# Altium project PolychaetaV0.PrjPcb
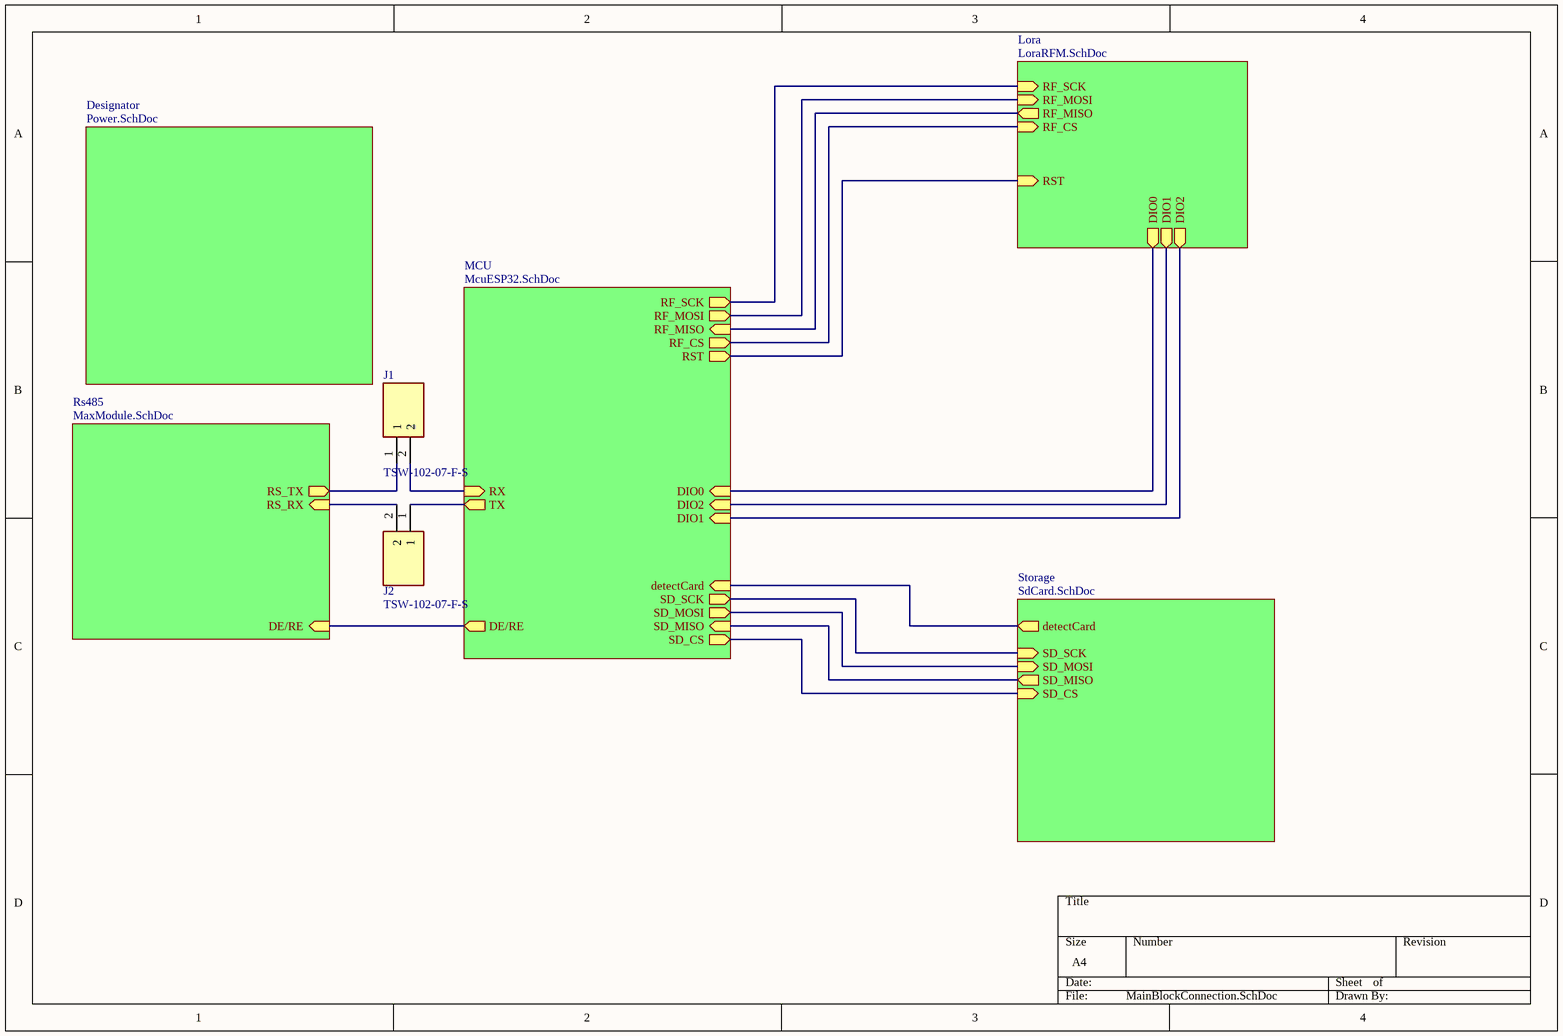
[diagram p0: MainBlockConnection.SchDoc]
6 sheets, 61 parts. Net scope: hierarchical (ports join the sheet entries above them; power ports are global).
Board file: PCBPolyESP.PcbDoc
Sheets:
  MainBlockConnection.SchDoc
    MCU = McuESP32.SchDoc
    Designator = Power.SchDoc
    Lora = LoraRFM.SchDoc
    Rs485 = MaxModule.SchDoc
    Storage = SdCard.SchDoc

## Sheet MainBlockConnection.SchDoc
size A4; SheetNumber: 1; SheetTotal: 6

### Parts
J1  TSW-102-07-F-S  [TSW-102-XX-YY-S]
J2  TSW-102-07-F-S  [TSW-102-XX-YY-S]

### Sub-sheets
Designator = Power.SchDoc: no entries
Lora = LoraRFM.SchDoc: RST (in), RF_MISO (out), RF_CS (in), RF_SCK (in), RF_MOSI (in), DIO0 (out), DIO1 (out), DIO2 (out)
MCU = McuESP32.SchDoc: TX (out), RX (in), RF_SCK (out), SD_MISO (in), SD_MOSI (out), RF_CS (out), SD_CS (out), SD_SCK (out), RF_MOSI (out), RF_MISO (in), RST (out), detectCard (in), DE/RE (out), DIO2 (in), DIO1 (in), DIO0 (in)
Rs485 = MaxModule.SchDoc: DE/RE (in), RS_TX (out), RS_RX (in)
Storage = SdCard.SchDoc: detectCard (out), SD_MOSI (in), SD_CS (in), SD_MISO (out), SD_SCK (in)

### Nets
ESP_RX: J1.2 ; sheet MCU/RX
ESP_TX: J2.1 ; sheet MCU/TX
NetIC1_8: sheet MCU/detectCard, sheet Storage/detectCard
NetIC1_9: sheet MCU/RST, sheet Lora/RST
NetIC1_10: sheet MCU/DIO2, sheet Lora/DIO1
NetIC1_11: sheet MCU/DIO1, sheet Lora/DIO2
NetIC1_12: sheet MCU/DIO0, sheet Lora/DIO0
NetIC1_13: sheet MCU/RF_SCK, sheet Lora/RF_SCK
NetIC1_14: sheet MCU/RF_MISO, sheet Lora/RF_MISO
NetIC1_16: sheet MCU/RF_MOSI, sheet Lora/RF_MOSI
NetIC1_23: sheet MCU/RF_CS, sheet Lora/RF_CS
NetIC1_29: sheet MCU/SD_CS, sheet Storage/SD_CS
NetIC1_30: sheet MCU/SD_SCK, sheet Storage/SD_SCK
NetIC1_31: sheet MCU/SD_MISO, sheet Storage/SD_MISO
NetIC1_36: sheet MCU/DE/RE, sheet Rs485/DE/RE
NetIC1_37: sheet MCU/SD_MOSI, sheet Storage/SD_MOSI
NetJ1_1: J1.1 ; sheet Rs485/RS_TX
NetJ2_2: J2.2 ; sheet Rs485/RS_RX

### Library data of the parts
J1 J2 = TSW-102-07-F-S: Connector; Manufacturer_Name: SAMTEC; Datasheet Link: http://suddendocs.samtec.com/prints/tsw-xxx-xx-xxx-x-xx-xxx-mkt.pdf; Manufacturer_Part_Number: TSW-102-07-F-S; Mouser Part Number: 200-TSW10207FS; Mouser Price/Stock: https://www.mouser.co.uk/ProductDetail/Samtec/TSW-102-07-F-S?qs=hzq9O0YpnZuC7JuvEqrjIA%3D%3D; Arrow Part Number: TSW-102-07-F-S; Arrow Price/Stock: https://www.arrow.com/en/products/tsw-102-07-f-s/samtec?utm_currency=USD&region=europe

## Sheet McuESP32.SchDoc
size A4; SheetNumber: 2; SheetTotal: 6
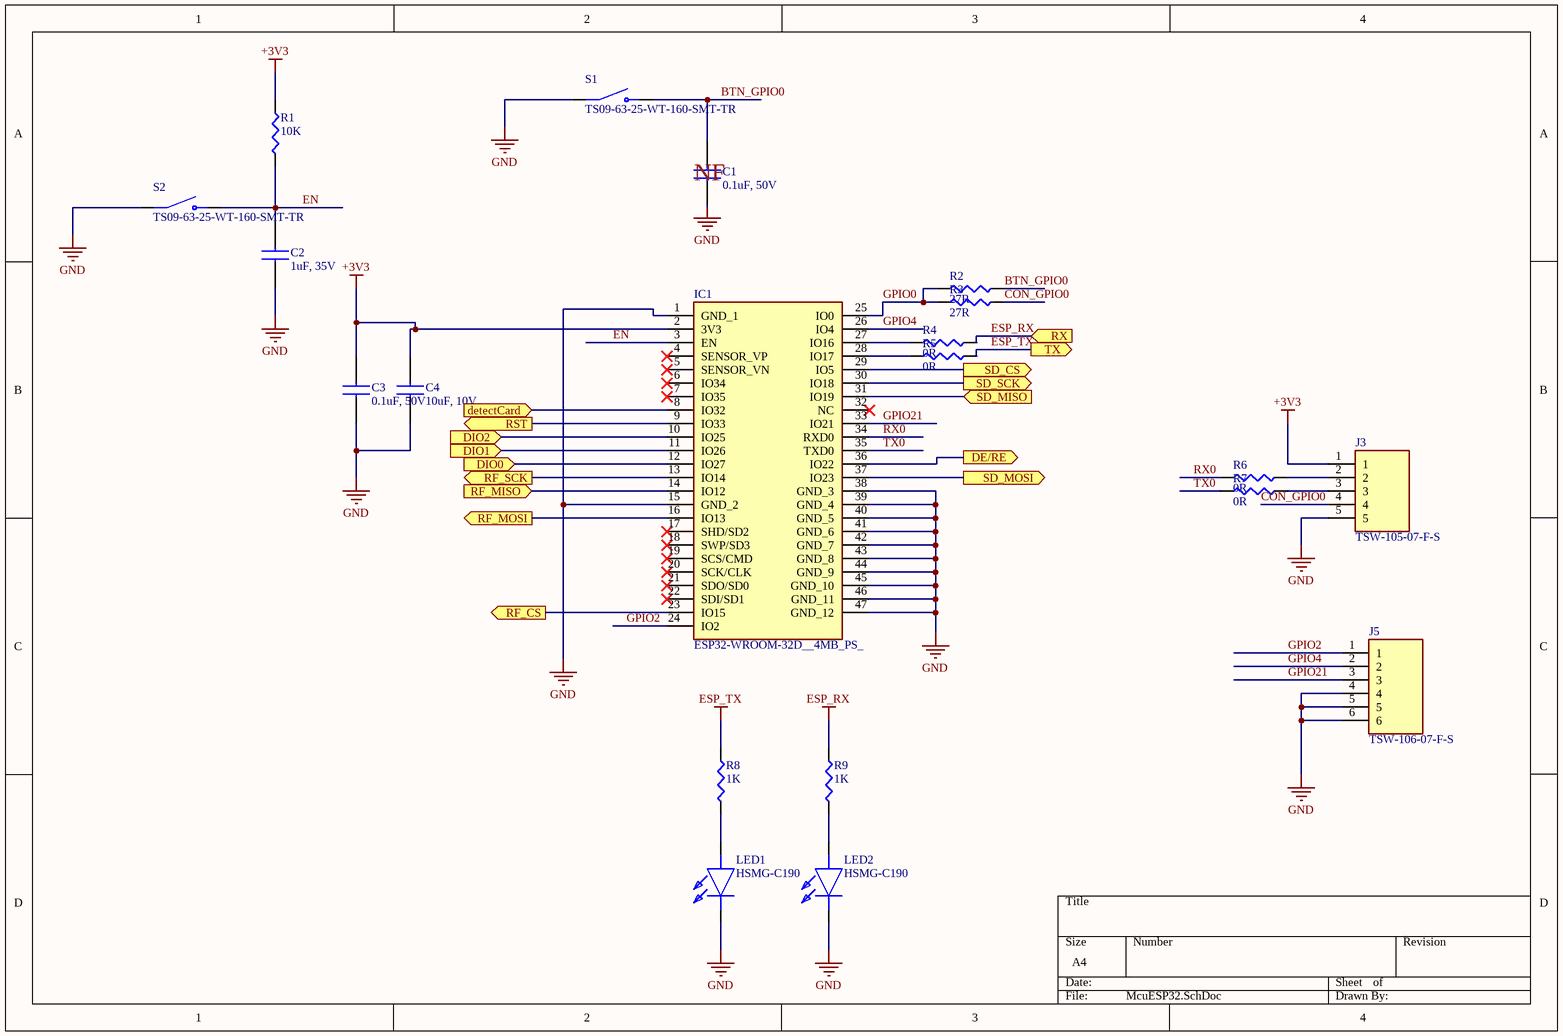
[diagram p1: McuESP32.SchDoc]

### Parts
C1  0.1uF, 50V  [CAPC1608X90N]
C2  1uF, 35V  [CAPC1608X90N]
C3  0.1uF, 50V  [CAPC1608X90N]
C4  10uF, 10V  [CAPC1608X90N]
IC1  ESP32-WROOM-32D__4MB_PS_  [ESP32WROOM32D4MBPS]
J3  TSW-105-07-F-S  [TSW-105-XX-YY-S]
J5  TSW-106-07-F-S  [TSW10607FS]
LED1  HSMG-C190  [LEDC1608X90N]
LED2  HSMG-C190  [LEDC1608X90N]
R1  10K  [RESC1607X60N]
R2  27R  [RESC1607X60N]
R3  27R  [RESC1607X60N]
R4  0R  [RESC1607X60N]
R5  0R  [RESC1607X60N]
R6  0R  [RESC1607X60N]
R7  0R  [RESC1607X60N]
R8  1K  [RESC1607X60N]
R9  1K  [RESC1607X60N]
S1  TS09-63-25-WT-160-SMT-TR  [SW_TS09-63-25-WT-160-SMT-TR]
S2  TS09-63-25-WT-160-SMT-TR  [SW_TS09-63-25-WT-160-SMT-TR]

### Ports
DE/RE (out), detectCard (in), DIO0 (in), DIO1 (in), DIO2 (in), RF_CS (out), RF_MISO (in), RF_MOSI (out), RF_SCK (out), RST (out), RX (in), SD_CS (out), SD_MISO (in), SD_MOSI (out), SD_SCK (out), TX (out)

### Nets
+3V3: C3.2 C4.1 IC1.2(3V3) J3.1 R1.2
ESP_RX: R4.2 R9.2 ; port RX
ESP_TX: R5.2 R8.2 ; port TX
GND: C1.1 C2.1 C3.1 C4.2 IC1.1(GND_1) IC1.15(GND_2) IC1.38(GND_3) IC1.39(GND_4) IC1.40(GND_5) IC1.41(GND_6) IC1.42(GND_7) IC1.43(GND_8) IC1.44(GND_9) IC1.45(GND_10) IC1.46(GND_11) IC1.47(GND_12) J3.5 J5.4 J5.5 J5.6 LED1.1(K) LED2.1(K) S1.1 S2.1
BTN_GPIO0: C1.2 R2.2 S1.2
CON_GPIO0: J3.4 R3.2
EN: C2.2 IC1.3(EN) R1.1 S2.2
GPIO0: IC1.25(IO0) R2.1 R3.1
GPIO2: IC1.24(IO2) J5.1
GPIO4: IC1.26(IO4) J5.2
GPIO21: IC1.33(IO21) J5.3
RX0: IC1.34(RXD0) R6.1
TX0: IC1.35(TXD0) R7.1
NetIC1_8: IC1.8(IO32) ; port detectCard
NetIC1_9: IC1.9(IO33) ; port RST
NetIC1_10: IC1.10(IO25) ; port DIO2
NetIC1_11: IC1.11(IO26) ; port DIO1
NetIC1_12: IC1.12(IO27) ; port DIO0
NetIC1_13: IC1.13(IO14) ; port RF_SCK
NetIC1_14: IC1.14(IO12) ; port RF_MISO
NetIC1_16: IC1.16(IO13) ; port RF_MOSI
NetIC1_23: IC1.23(IO15) ; port RF_CS
NetIC1_27: IC1.27(IO16) R4.1
NetIC1_28: IC1.28(IO17) R5.1
NetIC1_29: IC1.29(IO5) ; port SD_CS
NetIC1_30: IC1.30(IO18) ; port SD_SCK
NetIC1_31: IC1.31(IO19) ; port SD_MISO
NetIC1_36: IC1.36(IO22) ; port DE/RE
NetIC1_37: IC1.37(IO23) ; port SD_MOSI
NetJ3_2: J3.2 R6.2
NetJ3_3: J3.3 R7.2
NetLED1_2: LED1.2(A) R8.1
NetLED2_2: LED2.2(A) R9.1

Not connected (* = marked no-connect by the designer): IC1 4(SENSOR_VP)* 5(SENSOR_VN)* 6(IO34)* 7(IO35)* 17(SHD/SD2)* 18(SWP/SD3)* 19(SCS/CMD)* 20(SCK/CLK)* 21(SDO/SD0)* 22(SDI/SD1)* 32(NC)*

### Notes on the sheet
- (near C1) NF

### Library data of the parts
C1 C3 = CL10B104KB8NNNL: CAP CER 0.1UF 50V X7R 0603; Manufacturer_Name: SAMSUNG; Datasheet Link: https://componentsearchengine.com/Datasheets/2/CL10A106MP8NNNC.pdf; Height: 0.9mm; Manufacturer_Part_Number: CL10B104KB8NNNL; Mouser Part Number: 187-CL10A106MP8NNNC; Mouser Price/Stock: https://www.mouser.co.uk/ProductDetail/Samsung-Electro-Mechanics/CL10A106MP8NNNC?qs=X6jEic%2FHinAgjcVTZfg7UA%3D%3D; Arrow Part Number: CL10A106MP8NNNC; Arrow Price/Stock: https://www.arrow.com/en/products/cl10a106mp8nnnc/samsung-electro-mechanics?utm_currency=USD&region=europe
C2 = CL10A105KL8NNNC: Ceramic Capacitor, Multilayer, Ceramic, 35V, 10% +Tol, 10% -Tol, X5R, +-15% TC, 1uF, Surface Mount, 0603 inch; Manufacturer: Samsung; Material: 4241ConductorMaterial; Supplier 1: Digikey; Manufacturer Part Number: CL10A105KL8NNNC; RoHS: Yes; Category: Ceramic Capacitors; Stock 1: 11037; Pricing 1: 1=0,13, 10=0,073, 100=0,044, 1000=0,03277 (USD); Voltage Rating (DC): 35V; Height: 900um; Lead Free: 5697LeadFree; ComponentLink1URL: https://datasheet.ciiva.com/25773/cl10a105kl8nnnc-25773809.pdf?src-supplier=Digikey; ComponentLink1Description: https://datasheet.ciiva.com/25773/cl10a105kl8nnnc-25773809.pdf?src-supplier=Digikey; ComponentLink2URL: https://datasheet.ciiva.com/16202/clseries-16202344.pdf?src-supplier=Future+Electronics; ComponentLink2Description: https://datasheet.ciiva.com/16202/clseries-16202344.pdf?src-supplier=Future+Electronics
C4 = CL10A106MP8NNNC: CAP CER 10UF 10V X5R 0603; Manufacturer_Name: SAMSUNG; Datasheet Link: https://componentsearchengine.com/Datasheets/2/CL10A106MP8NNNC.pdf; Height: 0.9mm; Manufacturer_Part_Number: CL10A106MP8NNNC; Mouser Part Number: 187-CL10A106MP8NNNC; Mouser Price/Stock: https://www.mouser.co.uk/ProductDetail/Samsung-Electro-Mechanics/CL10A106MP8NNNC?qs=X6jEic%2FHinAgjcVTZfg7UA%3D%3D; Arrow Part Number: CL10A106MP8NNNC; Arrow Price/Stock: https://www.arrow.com/en/products/cl10a106mp8nnnc/samsung-electro-mechanics?utm_currency=USD&region=europe
IC1 = ESP32-WROOM-32D__4MB_PS_: Integrated Circuit; Manufacturer_Name: Espressif Systems; Manufacturer_Part_Number: ESP32-WROOM-32D (4MB PS); Datasheet Link: https://www.mouser.com/datasheet/2/891/esp32-wroom-32d_esp32-wroom-32u_datasheet_en-1365844.pdf; Height: 3.2mm; Mouser Part Number: 356-ESPWROOM3200PS3; Mouser Price/Stock: https://www.mouser.co.uk/ProductDetail/Espressif-Systems/ESP32-WROOM-32D-4MB-PS?qs=GBLSl2Akirs5uooPY1MBgw%3D%3D
J3 = TSW-105-07-F-S: Connector; Manufacturer_Name: SAMTEC; Datasheet Link: http://suddendocs.samtec.com/prints/tsw-xxx-xx-xxx-x-xx-xxx-mkt.pdf; Manufacturer_Part_Number: TSW-105-07-F-S; Mouser Part Number: 200-TSW10507FS; Mouser Price/Stock: https://www.mouser.co.uk/ProductDetail/Samtec/TSW-105-07-F-S?qs=rU5fayqh%252BE0rjSr2FD4jkw%3D%3D; Arrow Part Number: TSW-105-07-F-S; Arrow Price/Stock: https://www.arrow.com/en/products/tsw-105-07-f-s/samtec?region=europe
J5 = TSW-106-07-F-S: Connector; Manufacturer_Name: SAMTEC; Datasheet Link: http://suddendocs.samtec.com/prints/tsw-xxx-xx-xxx-x-xx-xxx-mkt.pdf; Height: 8.38mm; Manufacturer_Part_Number: TSW-106-07-F-S; Mouser Part Number: 200-TSW10607FS; Mouser Price/Stock: https://www.mouser.co.uk/ProductDetail/Samtec/TSW-106-07-F-S?qs=rU5fayqh%252BE1Xwj0%2Fe2Xn%2Fw%3D%3D; Arrow Part Number: TSW-106-07-F-S; Arrow Price/Stock: https://www.arrow.com/en/products/tsw-106-07-f-s/samtec?region=nac
LED1 LED2 = HSMG-C190: Green LED 0603 (1608 Metric); Manufacturer_Name: Avago Technologies; Datasheet Link: https://docs.broadcom.com/docs/AV02-0551EN; Height: 0.9mm; Manufacturer_Part_Number: HSMG-C190; Mouser Part Number: 630-HSMG-C190; Mouser Price/Stock: https://www.mouser.co.uk/ProductDetail/Broadcom-Avago/HSMG-C190?qs=YDL0qNrpDT605sxOaps8VQ%3D%3D
R1 = RC0603JR-0710KL: RES 10K OHM 5% 1/10W 0603; Manufacturer: Yageo; Resistance: 10kR; Temperature Coefficient: 100ppm/°C; Voltage Rating (AC): 50V; Max Power Dissipation: 100mW; Supplier 1: Digikey; Manufacturer Part Number: RC0603JR-0710KL; RoHS: Yes; Category: Chip SMD Resistors; Stock 1: 50431; Pricing 1: 1=0,1, 10=0,008, 50=0,0072, 100=0,0061, 500=0,0051 (USD); Case/Package: 0603; Min Operating Temperature: -55°C; Max Operating Temperature: 155°C; Tolerance: 5%; Number of Terminations: 2; Series: RC; Reach SVHC Compliant: 4187SVHC; Lead Free: 5697LeadFree; RoHS Compliant: Yes; ComponentLink1URL: https://datasheet.ciiva.com/2452/pyu-rc-group-51-rohs-l-10-2452848.pdf?src-supplier=Digikey; ComponentLink1Description: https://datasheet.ciiva.com/2452/pyu-rc-group-51-rohs-l-10-2452848.pdf?src-supplier=Digikey
R2 R3 = RC0603JR-0727RL: RES 27 OHM 5% 1/10W 0603; Manufacturer: Yageo; Voltage Rating (AC): 50V; Supplier 1: Digikey; Manufacturer Part Number: RC0603JR-0727RL; RoHS: Yes; Category: Chip SMD Resistors; Stock 1: 235857; Pricing 1: 1=0,1, 10=0,008, 50=0,0072, 100=0,0061, 500=0,00562, 1000=0,0051 (USD); Lead Free: 5697LeadFree; ComponentLink1URL: https://datasheet.ciiva.com/7746/443971-7746479.pdf?src-supplier=Element14; ComponentLink1Description: https://datasheet.ciiva.com/7746/443971-7746479.pdf?src-supplier=Element14
R4-R7 = RC0603JR-070RL: RES 0 OHM JUMPER 1/10W 0603; Manufacturer: Yageo; Resistance: 0mR; Tolerance: 1%; Voltage Rating: 50V; Power Rating: 100mW; Temperature Coefficient: 200ppm/°C; Resistance Tolerance: 5%; Supplier 1: Digikey; Manufacturer Part Number: RC0603JR-070RL; RoHS: Yes; Category: Chip SMD Resistors; Stock 1: 2438419; Pricing 1: 1=0,1, 10=0,01, 25=0,008, 50=0,0068, 100=0,0059, 250=0,00496, 500=0,00436, 1000=0,00384, 5000=0,00292, 10000=0,00262, 15000=0,00246, 25000=0,00229, 35000=0,00218, 50000=0,00208, 125000=0,00185, 250000=0,00171, 500000=0,00159 (USD); Case/Package: 0603; Number of Pins: 2; Case Code (Imperial): 0603; Contact Plating: Tin,Matte; Case Code (Metric): 1608; Size Code: 0603; Min Operating Temperature: -55°C; Max Operating Temperature: 155°C; Packaging: Tape and Reel; Voltage Rating (DC): 50V; Termination: SMD/SMT; Package Quantity: 5000; Resistor Type: Thick Film; Features: Moisture Resistant; Series: RC; Max Power Dissipation: 100mW; Number of Terminations: 2; Construction: Rectangular; Technology: THICK FILM; Length: 1.6mm; Width: 0.8mm; Height: 0.45mm; Depth: 0.8mm; Military Standard: Not; Reach SVHC Compliant: Unknown; Lead Free: 5697LeadFree; RoHS Compliant: Yes; ComponentLink1URL: https://datasheet.ciiva.com/11808/pyu-r-int-6-11808700.pdf?src-supplier=Rs; ComponentLink1Description: https://datasheet.ciiva.com/11808/pyu-r-int-6-11808700.pdf?src-supplier=Rs; ComponentLink2URL: https://datasheet.ciiva.com/22747/443971-22747530.pdf?src-supplier=Element14; ComponentLink2Description: https://datasheet.ciiva.com/22747/443971-22747530.pdf?src-supplier=Element14; ComponentLink3URL: https://datasheet.ciiva.com/12555/rc0603-272842-12555254.pdf?src-supplier=Mouser; ComponentLink3Description: https://datasheet.ciiva.com/12555/rc0603-272842-12555254.pdf?src-supplier=Mouser; ComponentLink4URL: https://datasheet.ciiva.com/7746/1738695-7746421.pdf?src-supplier=Element14; ComponentLink4Description: https://datasheet.ciiva.com/7746/1738695-7746421.pdf?src-supplier=Element14; ComponentLink5URL: https://datasheet.ciiva.com/7746/1738695-7746422.pdf?src-supplier=Element14; ComponentLink5Description: https://datasheet.ciiva.com/7746/1738695-7746422.pdf?src-supplier=Element14
R8 R9 = RT0603BRD071KL: Fixed Resistor, Thin Film, 0.1W, 1000ohm, 75V, 0.1% +/-Tol, 25ppm/Cel, Surface Mount, 0603; Manufacturer: Yageo; Resistance: 1kR; Power Rating: 100mW; Temperature Coefficient: 25ppm/°C; Voltage Rating (DC): 50V; Supplier 1: Digikey; Manufacturer Part Number: RT0603BRD071KL; RoHS: Yes; Category: Chip SMD Resistors; Stock 1: 60333; Pricing 1: 1=0,15, 10=0,108, 50=0,0868, 100=0,0775, 500=0,06018, 1000=0,05202 (USD); Mount: Surface Mount; Case/Package: 0603; Case Code (Metric): 1608; Case Code (Imperial): 0603; Contact Plating: Tin,Lead; Size Code: 0603; Min Operating Temperature: -55°C; Max Operating Temperature: 155°C; Package Quantity: 5000; Packaging: Tape and Reel; Voltage Rating: 75V; Number of Terminations: 2; Termination: SMD/SMT; Max Power Dissipation: 100mW; Features: Moisture Resistant; Series: RT; Technology: THIN FILM; Length: 0.063inch; Width: 0.031inch; Height: 0.022inch; Depth: 0.8mm; RoHS Compliant: Yes; Lead Free: 5697LeadFree; ComponentLink1URL: https://datasheet.ciiva.com/11819/0900766b8079c86e-11819652.pdf?src-supplier=Rs; ComponentLink1Description: https://datasheet.ciiva.com/11819/0900766b8079c86e-11819652.pdf?src-supplier=Rs; ComponentLink2URL: https://datasheet.ciiva.com/5624/pyu-rt-1-to-0-05-rohs-l-4-5624759.pdf?src-supplier=Mouser; ComponentLink2Description: https://datasheet.ciiva.com/5624/pyu-rt-1-to-0-05-rohs-l-4-5624759.pdf?src-supplier=Mouser
S1 S2 = TS09-63-25-WT-160-SMT-TR: SWITCH TACTILE SPST-NO 0.05A 12V; MF: Same Sky; SnapEDA_Link: https://www.snapeda.com/parts/TS09-63-25-WT-160-SMT-TR/Same+Sky/view-part/?ref=snap; Package: None; Value: *; MP: TS09-63-25-WT-160-SMT-TR; Check_prices: https://www.snapeda.com/parts/TS09-63-25-WT-160-SMT-TR/Same+Sky/view-part/?ref=eda

## Sheet Power.SchDoc
size A4; SheetNumber: 3; SheetTotal: 6
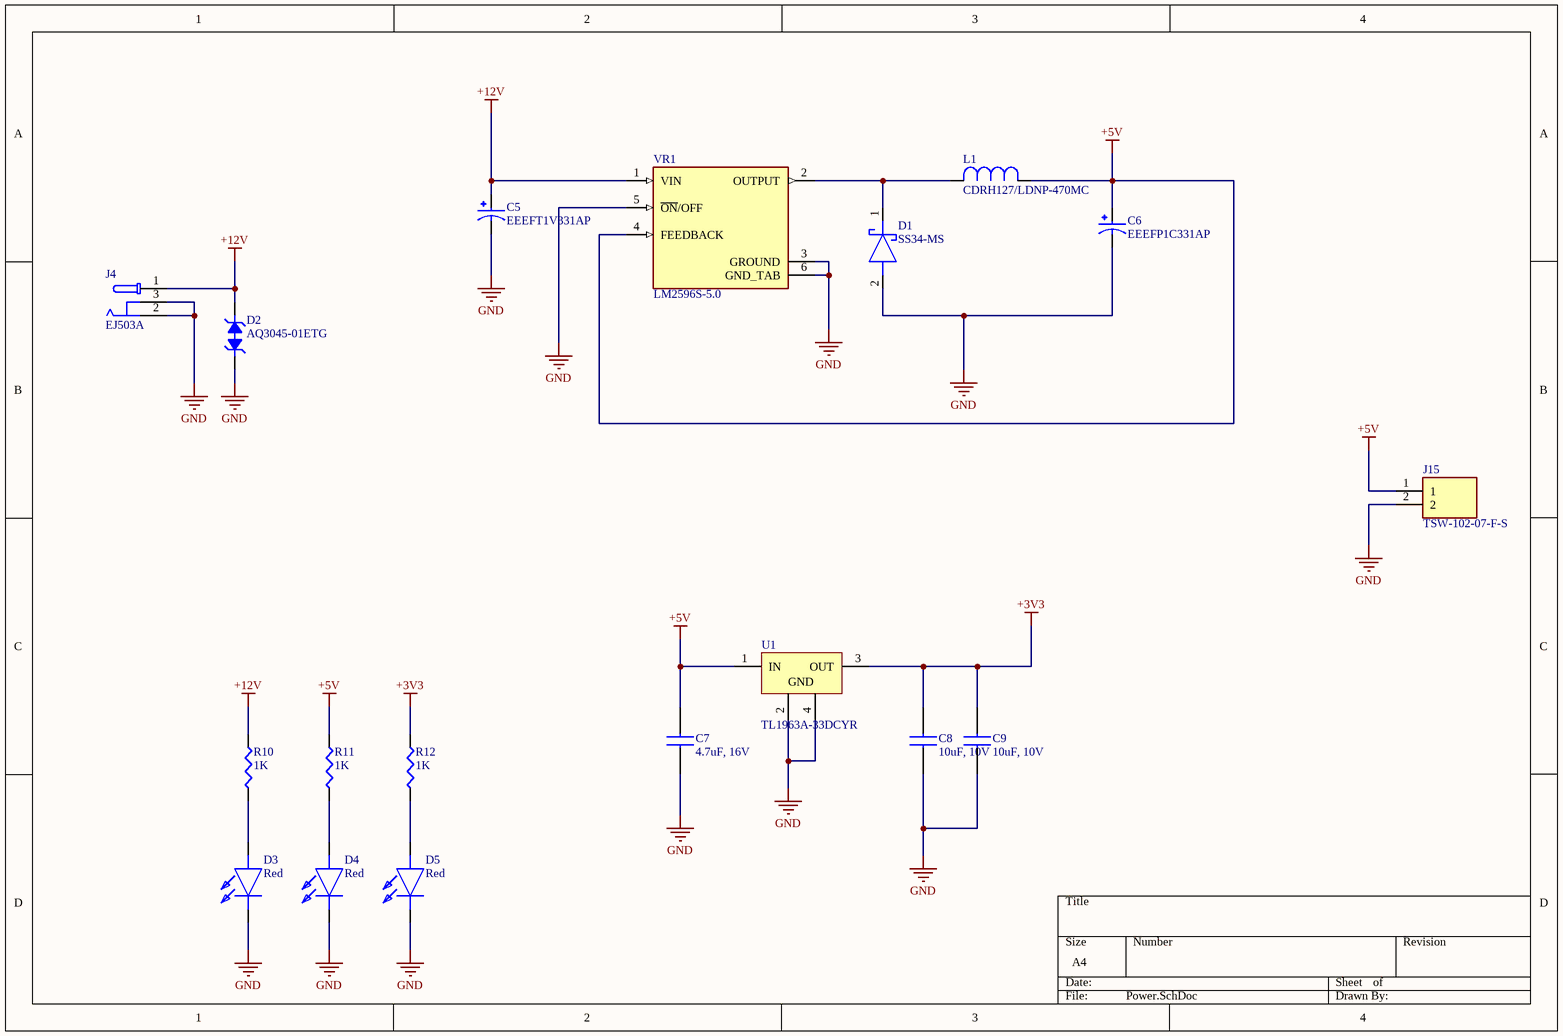
[diagram p2: Power.SchDoc]

### Parts
C5  EEEFT1V331AP  [CAP_EEEFT1V331AP]
C6  EEEFP1C331AP  [CAP_EEEFP1C331AP]
C7  4.7uF, 16V  [CAPC1608X90N]
C8  10uF, 10V  [CAPC1608X90N]
C9  10uF, 10V  [CAPC1608X90N]
D1  SS34-MS  [DIOM5127X241N]
D2  AQ3045-01ETG  [SOD882]
D3  Red  [LEDC1608X90N]
D4  Red  [LEDC1608X90N]
D5  Red  [LEDC1608X90N]
J4  EJ503A  [MPD_EJ503A]
J15  TSW-102-07-F-S  [TSW-102-XX-YY-S]
L1  CDRH127/LDNP-470MC  [IND_CDRH127/LDNP-470MC_SUM]
R10  1K  [RESC1607X60N]
R11  1K  [RESC1607X60N]
R12  1K  [RESC1607X60N]
U1  TL1963A-33DCYR  [DCY0004A_N]
VR1  LM2596S-5.0  [TO170P1524X483-6N]

### Nets
+3V3: C8.2 C9.2 R12.2 U1.3(OUT)
+5V: C6.1 C7.2 J15.1 L1.1 R11.2 U1.1(IN) VR1.4(FEEDBACK)
+12V: C5.1 D2.2 J4.1 R10.2 VR1.1(VIN)
GND: C5.2 C6.2 C7.1 C8.1 C9.1 D1.2(A) D2.1 D3.1(K) D4.1(K) D5.1(K) J4.2 J4.3 J15.2 U1.2(GND) U1.4(GND) VR1.3(GROUND) VR1.5(~{ON}/OFF) VR1.6(GND_TAB)
NetD1_1: D1.1(K) L1.2 VR1.2(OUTPUT)
NetD3_2: D3.2(A) R10.1
NetD4_2: D4.2(A) R11.1
NetD5_2: D5.2(A) R12.1

### Library data of the parts
C5 = EEEFT1V331AP: CAP ALUM 330UF 20% 35V SMD; MF: Panasonic Electronic; MP: EEE-FT1V331AP; SnapEDA_Link: https://www.snapeda.com/parts/EEE-FT1V331AP/Panasonic/view-part/?ref=snap; Package: RADIAL-2 Panasonic; Value: *; Check_prices: https://www.snapeda.com/parts/EEE-FT1V331AP/Panasonic/view-part/?ref=eda
C6 = EEEFP1C331AP: CAP ALUM 330UF 20% 16V SMD; MF: Panasonic Electronic; MP: EEE-FP1C331AP; SnapEDA_Link: https://www.snapeda.com/parts/EEE-FP1C331AP/Panasonic/view-part/?ref=snap; Package: RADIAL-2 Panasonic; Value: *; Check_prices: https://www.snapeda.com/parts/EEE-FP1C331AP/Panasonic/view-part/?ref=eda
C7 = CL10A475KO8NNNC: CAP CER 4,7UF 16V X5R 0603; Manufacturer_Name: SAMSUNG; Datasheet Link: https://componentsearchengine.com/Datasheets/2/CL10A106MP8NNNC.pdf; Height: 0.9mm; Manufacturer_Part_Number: CL10A475KO8NNNC; Mouser Part Number: 187-CL10A106MP8NNNC; Mouser Price/Stock: https://www.mouser.co.uk/ProductDetail/Samsung-Electro-Mechanics/CL10A106MP8NNNC?qs=X6jEic%2FHinAgjcVTZfg7UA%3D%3D; Arrow Part Number: CL10A106MP8NNNC; Arrow Price/Stock: https://www.arrow.com/en/products/cl10a106mp8nnnc/samsung-electro-mechanics?utm_currency=USD&region=europe
C8 C9 = CL10A106MP8NNNC: as C4 on sheet McuESP32; Datasheet Link: https://componentsearchengine.com/Datasheets/2/CL10A106MP8NNNC.pdf; Height: 0.9mm; Manufacturer_Part_Number: CL10A106MP8NNNC; Mouser Part Number: 187-CL10A106MP8NNNC; Mouser Price/Stock: https://www.mouser.co.uk/ProductDetail/Samsung-Electro-Mechanics/CL10A106MP8NNNC?qs=X6jEic%2FHinAgjcVTZfg7UA%3D%3D; Arrow Part Number: CL10A106MP8NNNC; Arrow Price/Stock: https://www.arrow.com/en/products/cl10a106mp8nnnc/samsung-electro-mechanics?utm_currency=USD&region=europe
D1 = SS34-MS: Schottky Diode; Manufacturer_Name: MSKSEMI; Datasheet Link: https://datasheet.lcsc.com/lcsc/2202131930_MSKSEMI-SS34-MS_C2836396.pdf; Height: 2.41mm; Manufacturer_Part_Number: SS34-MS
D2 = AQ3045-01ETG: TVS DIODE 5.3VWM 12VC SOD882; Manufacturer: Littelfuse; Diode Element Material: SILICON; Package Body Material: Plastic; Polarity: Bidirectional; Max Breakdown Voltage: 9V; Min Breakdown Voltage: 6.8V; Diode Type: TRANS VOLTAGE SUPPRESSOR; Non-rep Peak Rev Power Dis-Max: 40W; Number of Elements: 1; Rep Pk Reverse Voltage-Max: 5.3V; Reference Standard: AEC-Q101; Supplier: Digikey; Supplier Part Number: F9321CT-ND; Manufacturer Part Number: AQ3045-01ETG; RoHS: Yes; Category: TVS Diodes; Stock: 21664; Pricing: 1=0.5, 10=0.391, 100=0.2344, 500=0.217, 1000=0.14756, 2000=0.13585, 5000=0.1302 (USD); Pins: 2; Package Shape: Rectangular; Min Operating Temperature: -55°C; Max Operating Temperature: 150°C; Package Style: CHIP CARRIERMeter; Surface Mount: Yes; Technology: AVALANCHE; Terminal Form: No Lead; Terminal Position: BOTTOM; Reach SVHC Compliant: Yes; RoHS Compliant: Yes; ComponentLink1URL: https://datasheet.ciiva.com:443/pdfs/VipMasterIC/IC/LFSI/LFSI-S-A0007892042/LFSI-S-A0007892042-1.pdf?src-supplier=IHS+Markit; ComponentLink1Description: https://datasheet.ciiva.com:443/pdfs/VipMasterIC/IC/LFSI/LFSI-S-A0007892042/LFSI-S-A0007892042-1.pdf?src-supplier=IHS+Markit; ComponentLink2URL: https://www.littelfuse.com/~/media/electronics/datasheets/tvs_diode_arrays/littelfuse_tvs_diode_array_aq3045_datasheet.pdf.pdf?src-supplier=Digikey; ComponentLink2Description: https://www.littelfuse.com/~/media/electronics/datasheets/tvs_diode_arrays/littelfuse_tvs_diode_array_aq3045_datasheet.pdf.pdf?src-supplier=Digikey; ComponentLink3URL: http://www.littelfuse.com/~/media/electronics/datasheets/tvs_diode_arrays/littelfuse_tvs_diode_array_aq3045_datasheet.pdf.pdf?src-supplier=Digikey; ComponentLink3Description: http://www.littelfuse.com/~/media/electronics/datasheets/tvs_diode_arrays/littelfuse_tvs_diode_array_aq3045_datasheet.pdf.pdf?src-supplier=Digikey; LCSC Part Number: C3710326
D3-D5 = HSMS-C190: Red LED 0603 (1608 Metric); Manufacturer_Name: Avago Technologies; Manufacturer_Part_Number: HSMG-C190; Datasheet Link: https://docs.broadcom.com/docs/AV02-0551EN; Height: 0.9mm; Mouser Part Number: 630-HSMG-C190; Mouser Price/Stock: https://www.mouser.co.uk/ProductDetail/Broadcom-Avago/HSMG-C190?qs=YDL0qNrpDT605sxOaps8VQ%3D%3D
J4 = EJ503A: Power Barrel Connector Jack 2.10mm ID (0.083), 5.50mm OD (0.217) Through Hole, Right Angle; MF: MPD; Package: None; Price: None; Check_prices: https://www.snapeda.com/parts/EJ503A/MPD+%2528Memory+Protection+Devices%2529/view-part/?ref=eda; Value: *; SnapEDA_Link: https://www.snapeda.com/parts/EJ503A/MPD+%2528Memory+Protection+Devices%2529/view-part/?ref=snap; MP: EJ503A; Availability: In Stock; Purchase-URL: https://pricing.snapeda.com/search?q=EJ503A&ref=eda
J15 = TSW-102-07-F-S: Connector; Manufacturer_Name: SAMTEC; Datasheet Link: http://suddendocs.samtec.com/prints/tsw-xxx-xx-xxx-x-xx-xxx-mkt.pdf; Manufacturer_Part_Number: TSW-102-07-F-S; Mouser Part Number: 200-TSW10207FS; Mouser Price/Stock: https://www.mouser.co.uk/ProductDetail/Samtec/TSW-102-07-F-S?qs=hzq9O0YpnZuC7JuvEqrjIA%3D%3D; Arrow Part Number: TSW-102-07-F-S; Arrow Price/Stock: https://www.arrow.com/en/products/tsw-102-07-f-s/samtec?utm_currency=USD&region=europe
L1 = CDRH127/LDNP-470MC: Inductor Power Shielded Drum Core 47uH 20% 1KHz Ferrite 4.1A 0.078Ohm DCR T/R; MF: Sumida Corporation; SnapEDA_Link: https://www.snapeda.com/parts/CDRH127/LDNP-470MC/Sumida/view-part/?ref=snap; Package: Non Standard Sumida; Value: *; MP: CDRH127/LDNP-470MC; Check_prices: https://www.snapeda.com/parts/CDRH127/LDNP-470MC/Sumida/view-part/?ref=eda
R10-R12 = RT0603BRD071KL: as R8 on sheet McuESP32; Supplier 1: Digikey; Manufacturer Part Number: RT0603BRD071KL; RoHS: Yes; Category: Chip SMD Resistors; Stock 1: 60333; Pricing 1: 1=0,15, 10=0,108, 50=0,0868, 100=0,0775, 500=0,06018, 1000=0,05202 (USD); Mount: Surface Mount; Case/Package: 0603; Case Code (Metric): 1608; Case Code (Imperial): 0603; Contact Plating: Tin,Lead; Size Code: 0603; Min Operating Temperature: -55°C; Max Operating Temperature: 155°C; Package Quantity: 5000; Packaging: Tape and Reel; Voltage Rating: 75V; Number of Terminations: 2; Termination: SMD/SMT; Max Power Dissipation: 100mW; Features: Moisture Resistant; Series: RT; Technology: THIN FILM; Length: 0.063inch; Width: 0.031inch; Height: 0.022inch; Depth: 0.8mm; RoHS Compliant: Yes; Lead Free: 5697LeadFree; ComponentLink1URL: https://datasheet.ciiva.com/11819/0900766b8079c86e-11819652.pdf?src-supplier=Rs; ComponentLink1Description: https://datasheet.ciiva.com/11819/0900766b8079c86e-11819652.pdf?src-supplier=Rs; ComponentLink2URL: https://datasheet.ciiva.com/5624/pyu-rt-1-to-0-05-rohs-l-4-5624759.pdf?src-supplier=Mouser; ComponentLink2Description: https://datasheet.ciiva.com/5624/pyu-rt-1-to-0-05-rohs-l-4-5624759.pdf?src-supplier=Mouser
U1 = TL1963A-33DCYR: IC REG LINEAR 3.3V 1.5A SOT223-4; Manufacturer: Texas Instruments; Package Body Material: Plastic; Adjustability: FIXED; Dropout Voltage1-Max: 550mV; Dropout Voltage1-Nom: 340mV; Input Voltage Absolute-Max: 20V; Min Input Voltage: 3.8V; Line Regulation-Max: 0.01%; Load Regulation-Max: 0.07%; Channels: 1; Output Voltage1-Max: 3.4V; Output Voltage1-Min: 3.2V; Regulator Type: FIXED POSITIVE SINGLE OUTPUT LDO REGULATOR; Voltage Tolerance-Max: 3%; Qualification Status: Not Qualified; Supplier: Digikey; Supplier Part Number: 296-24897-1-ND; Manufacturer Part Number: TL1963A-33DCYR; RoHS: Yes; Category: Voltage Regulators - Linear; Stock: 4105; Pricing: 1=2.91, 10=2.614, 25=2.4712, 100=2.1417, 250=2.03188, 500=1.8232, 1000=1.53764 (USD); Case/Package: SOP; Pins: 4; Package Shape: Rectangular; Terminal Finish: Tin; JESD-609 Code: e3; Max Supply Voltage: 20V; JESD-30 Code: R-PDSO-G4; Moisture Sensitivity Level: 2; Number of Outputs: 1; Operating Temperature, TJ-Max: 125°C; Operating Temperature, TJ-Min: -40°C; Output Current1-Max: 1.5A; Output Voltage1-Nom: 3.3V; Package Style: SMALL OUTLINEMeter; Packaging: Tape and Reel; Peak Reflow Temperature (Cel): 260°C; Surface Mount: Yes; Technology: BIPOLAR; Terminal Form: Gull Wing; Terminal Position: DUAL; Length: 6.5mm; Width: 3.5mm; Height - Seated (Max): 1.8mm; Terminal Pitch: 2.3mm; Reach SVHC Compliant: Yes; RoHS Compliant: Yes; ComponentLink1URL: https://www.ti.com:443/lit/ds/symlink/tl1963a.pdf?src-supplier=IHS+Markit; ComponentLink1Description: https://www.ti.com:443/lit/ds/symlink/tl1963a.pdf?src-supplier=IHS+Markit; ComponentLink2URL: https://datasheet.ciiva.com/2046/-2046068.pdf?src-supplier=Digikey; ComponentLink2Description: https://datasheet.ciiva.com/2046/-2046068.pdf?src-supplier=Digikey; LCSC Part Number: C181262
VR1 = LM2596S-5.0: SIMPLE SWITCHERÂ® 4.5V to 40V, 3A Low Component Count Step-Down Regulator; MF: Texas Instruments; MP: LM2596S-5.0/NOPB; SnapEDA_Link: https://www.snapeda.com/parts/LM2596S-5.0/NOPB/Texas+Instruments/view-part/?ref=snap; Package: TO-263-5 Texas Instruments; Value: *; Check_prices: https://www.snapeda.com/parts/LM2596S-5.0/NOPB/Texas+Instruments/view-part/?ref=eda

## Sheet LoraRFM.SchDoc
size A4; SheetNumber: 4; SheetTotal: 6
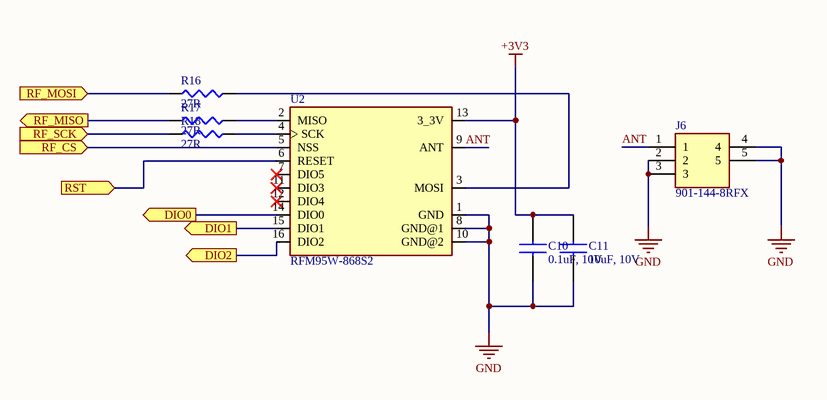
[diagram p3: LoraRFM.SchDoc]

### Parts
C10  0.1uF, 10V  [CAPC1608X90N]
C11  10uF, 10V  [CAPC1608X90N]
J6  901-144-8RFX  [9011448RFX]
R16  27R  [RESC1607X60N]
R17  27R  [RESC1607X60N]
R18  27R  [RESC1607X60N]
U2  RFM95W-868S2  [XCVR_RFM95W-868S2]

### Ports
DIO0 (out), DIO1 (out), DIO2 (out), RF_CS (in), RF_MISO (out), RF_MOSI (in), RF_SCK (in), RST (in)

### Nets
+3V3: C10.2 C11.2 U2.13(3_3V)
GND: C10.1 C11.1 J6.2 J6.3 J6.4 J6.5 U2.1(GND) U2.8(GND@1) U2.10(GND@2)
ANT: J6.1 U2.9(ANT)
NetIC1_9: U2.6(RESET) ; port RST
NetIC1_10: U2.15(DIO1) ; port DIO1
NetIC1_11: U2.16(DIO2) ; port DIO2
NetIC1_12: U2.14(DIO0) ; port DIO0
NetIC1_13: R18.1 ; port RF_SCK
NetIC1_14: R17.1 ; port RF_MISO
NetIC1_16: R16.1 ; port RF_MOSI
NetIC1_23: U2.5(NSS) ; port RF_CS
NetR16_2: R16.2 U2.3(MOSI)
NetR17_2: R17.2 U2.2(MISO)
NetR18_2: R18.2 U2.4(SCK)

Not connected (* = marked no-connect by the designer): U2 7(DIO5)* 11(DIO3)* 12(DIO4)*

### Library data of the parts
C10 = C0603C104K8RACTU: CAP CER 0.1UF 10V X7R 0603; Manufacturer_Name: KEMET; Datasheet Link: https://componentsearchengine.com/Datasheets/2/CL10A106MP8NNNC.pdf; Height: 0.9mm; Manufacturer_Part_Number: C0603C104K8RACTU; Mouser Part Number: 187-CL10A106MP8NNNC; Mouser Price/Stock: https://www.mouser.co.uk/ProductDetail/Samsung-Electro-Mechanics/CL10A106MP8NNNC?qs=X6jEic%2FHinAgjcVTZfg7UA%3D%3D; Arrow Part Number: CL10A106MP8NNNC; Arrow Price/Stock: https://www.arrow.com/en/products/cl10a106mp8nnnc/samsung-electro-mechanics?utm_currency=USD&region=europe
C11 = CL10A106MP8NNNC: as C4 on sheet McuESP32; Datasheet Link: https://componentsearchengine.com/Datasheets/2/CL10A106MP8NNNC.pdf; Height: 0.9mm; Manufacturer_Part_Number: CL10A106MP8NNNC; Mouser Part Number: 187-CL10A106MP8NNNC; Mouser Price/Stock: https://www.mouser.co.uk/ProductDetail/Samsung-Electro-Mechanics/CL10A106MP8NNNC?qs=X6jEic%2FHinAgjcVTZfg7UA%3D%3D; Arrow Part Number: CL10A106MP8NNNC; Arrow Price/Stock: https://www.arrow.com/en/products/cl10a106mp8nnnc/samsung-electro-mechanics?utm_currency=USD&region=europe
J6 = 901-144-8RFX: Connector; Manufacturer_Name: Amphenol; Datasheet Link: https://componentsearchengine.com/Datasheets/1/901-144-8RFX.pdf; Height: 9.53mm; Manufacturer_Part_Number: 901-144-8RFX; Mouser Part Number: 523-901-144-8RFX; Mouser Price/Stock: https://www.mouser.co.uk/ProductDetail/Amphenol-RF/901-144-8RFX?qs=jpOL8GWAqat%252BbPjbt8toTg%3D%3D; Arrow Part Number: 901-144-8RFX; Arrow Price/Stock: https://www.arrow.com/en/products/901-144-8rfx/amphenol-rf?region=europe
R16-R18 = RC0603JR-0727RL: as R2 on sheet McuESP32; Supplier 1: Digikey; Manufacturer Part Number: RC0603JR-0727RL; RoHS: Yes; Category: Chip SMD Resistors; Stock 1: 235857; Pricing 1: 1=0,1, 10=0,008, 50=0,0072, 100=0,0061, 500=0,00562, 1000=0,0051 (USD); Lead Free: 5697LeadFree; ComponentLink1URL: https://datasheet.ciiva.com/7746/443971-7746479.pdf?src-supplier=Element14; ComponentLink1Description: https://datasheet.ciiva.com/7746/443971-7746479.pdf?src-supplier=Element14
U2 = RFM95W-868S2: General ISM < 1GHz LoRaâ„¢ Transceiver Module 868MHz Antenna Not Included Surface Mount; MF: RF; Package: Non Standard RF Solutions; Price: None; Check_prices: https://www.snapeda.com/parts/RFM95W-868S2/RF+Solutions/view-part/?ref=eda; Value: *; SnapEDA_Link: https://www.snapeda.com/parts/RFM95W-868S2/RF+Solutions/view-part/?ref=snap; MP: RFM95W-868S2; Availability: In Stock; Purchase-URL: https://pricing.snapeda.com/search?q=RFM95W-868S2&ref=eda

## Sheet MaxModule.SchDoc
size A4; SheetNumber: 5; SheetTotal: 6
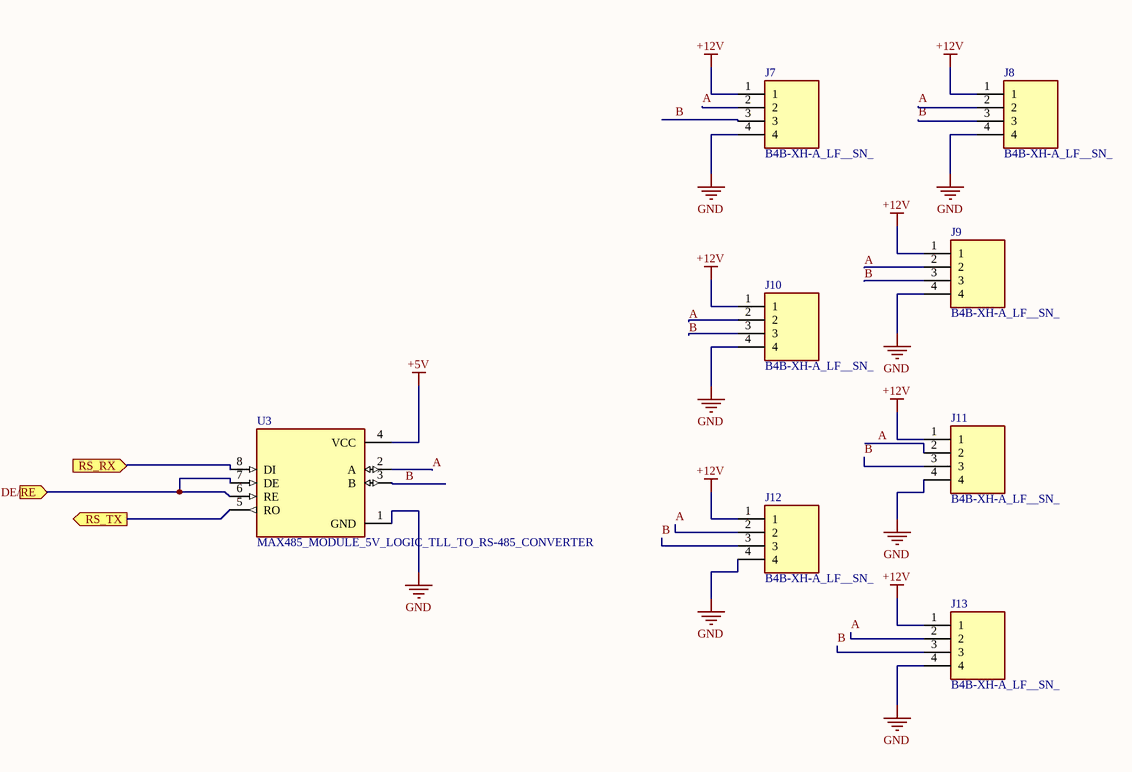
[diagram p4: MaxModule.SchDoc]

### Parts
J7  B4B-XH-A_LF__SN_  [B4BXHALFSN]
J8  B4B-XH-A_LF__SN_  [B4BXHALFSN]
J9  B4B-XH-A_LF__SN_  [B4BXHALFSN]
J10  B4B-XH-A_LF__SN_  [B4BXHALFSN]
J11  B4B-XH-A_LF__SN_  [B4BXHALFSN]
J12  B4B-XH-A_LF__SN_  [B4BXHALFSN]
J13  B4B-XH-A_LF__SN_  [B4BXHALFSN]
U3  MAX485_MODULE_5V_LOGIC_TLL_TO_RS-485_CONVERTER  [MODULE_MAX485_MODULE_5V_LOGIC_TLL_TO_RS-485_CONVERTER]

### Ports
DE/RE (in), RS_RX (in), RS_TX (out)

### Nets
+5V: U3.4(VCC)
+12V: J7.1 J8.1 J9.1 J10.1 J11.1 J12.1 J13.1
GND: J7.4 J8.4 J9.4 J10.4 J11.4 J12.4 J13.4 U3.1(GND)
A: J7.2 J8.2 J9.2 J10.2 J11.2 J12.2 J13.2 U3.2(A)
B: J7.3 J8.3 J9.3 J10.3 J11.3 J12.3 J13.3 U3.3(B)
NetIC1_36: U3.6(RE) U3.7(DE) ; port DE/RE
NetJ1_1: U3.5(RO) ; port RS_TX
NetJ2_2: U3.8(DI) ; port RS_RX

### Library data of the parts
J7-J13 = B4B-XH-A_LF__SN_: Connector; Manufacturer_Name: JST (JAPAN SOLDERLESS TERMINALS); Manufacturer_Part_Number: B4B-XH-A(LF)(SN); Datasheet Link: https://datasheet.lcsc.com/szlcsc/JST-Sales-America-B4B-XH-A-LF-SN_C144395.pdf; Height: 7mm; Mouser Part Number: 306-B4BXHALFSN; Mouser Price/Stock: https://www.mouser.co.uk/ProductDetail/JST-Commercial/B4B-XH-ALFSN?qs=cdbOS8ANM9CfC08d%252BywhFw%3D%3D; Arrow Part Number: B4B-XH-A(LF)(SN); Arrow Price/Stock: https://www.arrow.com/en/products/b4b-xh-a-lf-sn/jst-manufacturing?utm_currency=USD&region=europe
U3 = MAX485_MODULE_5V_LOGIC_TLL_TO_RS-485_CONVERTER: 5V MAX485 TTL To RS485 Converter Module Board for Arduino; MP: MAX485 Module 5V logic TLL to RS-485 converter; MF: e-Gizmo Mechatronix Central; Value: *; SnapEDA_Link: https://www.snapeda.com/parts/MAX485%20Module%205V%20logic%20TLL%20to%20RS-485%20converter/e-Gizmo+Mechatronix+Central/view-part/?ref=snap; Package: Package; Availability: Not in stock; Check_prices: https://www.snapeda.com/parts/MAX485%20Module%205V%20logic%20TLL%20to%20RS-485%20converter/e-Gizmo+Mechatronix+Central/view-part/?ref=eda; Price: None

## Sheet SdCard.SchDoc
size A4; SheetNumber: 6; SheetTotal: 6
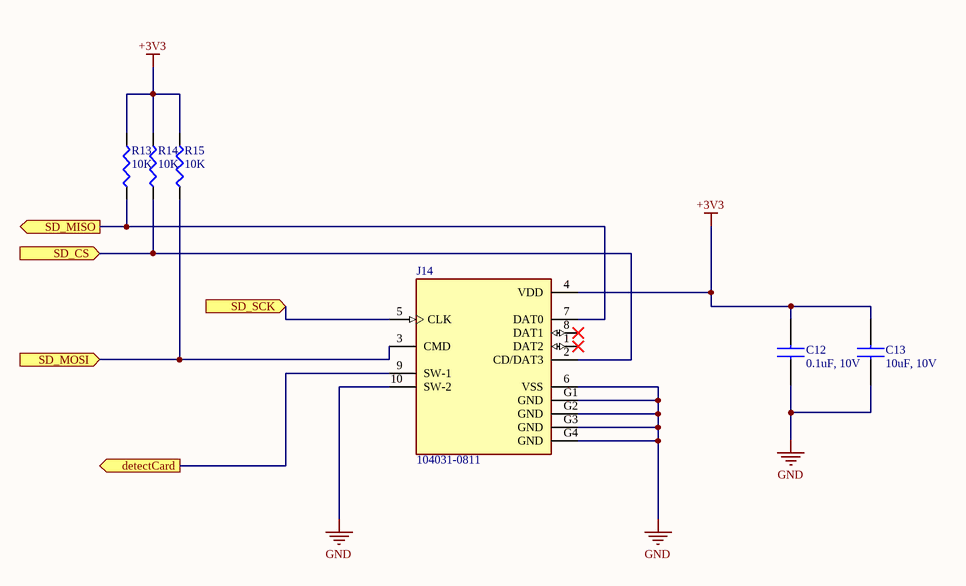
[diagram p5: SdCard.SchDoc]

### Parts
C12  0.1uF, 10V  [CAPC1608X90N]
C13  10uF, 10V  [CAPC1608X90N]
J14  104031-0811  [MOLEX_104031-0811]
R13  10K  [RESC1607X60N]
R14  10K  [RESC1607X60N]
R15  10K  [RESC1607X60N]

### Ports
detectCard (out), SD_CS (in), SD_MISO (out), SD_MOSI (in), SD_SCK (in)

### Nets
+3V3: C12.2 C13.2 J14.4(VDD) R13.2 R14.2 R15.2
GND: C12.1 C13.1 J14.6(VSS) J14.10(SW-2) J14.G1(GND) J14.G2(GND) J14.G3(GND) J14.G4(GND)
NetIC1_8: J14.9(SW-1) ; port detectCard
NetIC1_29: J14.2(CD/DAT3) R14.1 ; port SD_CS
NetIC1_30: J14.5(CLK) ; port SD_SCK
NetIC1_31: J14.7(DAT0) R13.1 ; port SD_MISO
NetIC1_37: J14.3(CMD) R15.1 ; port SD_MOSI

Not connected (* = marked no-connect by the designer): J14 1(DAT2)* 8(DAT1)*

### Library data of the parts
C12 = C0603C104K8RACTU: as C10 on sheet LoraRFM; Datasheet Link: https://componentsearchengine.com/Datasheets/2/CL10A106MP8NNNC.pdf; Height: 0.9mm; Manufacturer_Part_Number: C0603C104K8RACTU; Mouser Part Number: 187-CL10A106MP8NNNC; Mouser Price/Stock: https://www.mouser.co.uk/ProductDetail/Samsung-Electro-Mechanics/CL10A106MP8NNNC?qs=X6jEic%2FHinAgjcVTZfg7UA%3D%3D; Arrow Part Number: CL10A106MP8NNNC; Arrow Price/Stock: https://www.arrow.com/en/products/cl10a106mp8nnnc/samsung-electro-mechanics?utm_currency=USD&region=europe
C13 = CL10A106MP8NNNC: as C4 on sheet McuESP32; Datasheet Link: https://componentsearchengine.com/Datasheets/2/CL10A106MP8NNNC.pdf; Height: 0.9mm; Manufacturer_Part_Number: CL10A106MP8NNNC; Mouser Part Number: 187-CL10A106MP8NNNC; Mouser Price/Stock: https://www.mouser.co.uk/ProductDetail/Samsung-Electro-Mechanics/CL10A106MP8NNNC?qs=X6jEic%2FHinAgjcVTZfg7UA%3D%3D; Arrow Part Number: CL10A106MP8NNNC; Arrow Price/Stock: https://www.arrow.com/en/products/cl10a106mp8nnnc/samsung-electro-mechanics?utm_currency=USD&region=europe
J14 = 104031-0811: Surface Mount Micro SD Card Connector, with Push In Termination | Molex Incorporated 104031-0811; SnapEDA_Link: https://www.snapeda.com/parts/104031-0811/Molex/view-part/?ref=snap; Package: None; Value: *; MF: Molex; MP: 104031-0811; Check_prices: https://www.snapeda.com/parts/104031-0811/Molex/view-part/?ref=eda
R13-R15 = RC0603JR-0710KL: as R1 on sheet McuESP32; Supplier 1: Digikey; Manufacturer Part Number: RC0603JR-0710KL; RoHS: Yes; Category: Chip SMD Resistors; Stock 1: 50431; Pricing 1: 1=0,1, 10=0,008, 50=0,0072, 100=0,0061, 500=0,0051 (USD); Case/Package: 0603; Min Operating Temperature: -55°C; Max Operating Temperature: 155°C; Tolerance: 5%; Number of Terminations: 2; Series: RC; Reach SVHC Compliant: 4187SVHC; Lead Free: 5697LeadFree; RoHS Compliant: Yes; ComponentLink1URL: https://datasheet.ciiva.com/2452/pyu-rc-group-51-rohs-l-10-2452848.pdf?src-supplier=Digikey; ComponentLink1Description: https://datasheet.ciiva.com/2452/pyu-rc-group-51-rohs-l-10-2452848.pdf?src-supplier=Digikey

## Nets that join several sheets
+3V3: McuESP32 (5 pins), Power (C8.2 C9.2 R12.2 U1.3), LoraRFM (C10.2 C11.2 U2.13), SdCard (6 pins)
+5V: Power (7 pins), MaxModule (U3.4)
+12V: Power (5 pins), MaxModule (7 pins)
ESP_RX: MainBlockConnection (J1.2), McuESP32 (R4.2 R9.2)
ESP_TX: MainBlockConnection (J2.1), McuESP32 (R5.2 R8.2)
GND: McuESP32 (24 pins), Power (18 pins), LoraRFM (9 pins), MaxModule (8 pins), SdCard (8 pins)
NetIC1_8: McuESP32 (IC1.8), SdCard (J14.9)
NetIC1_9: McuESP32 (IC1.9), LoraRFM (U2.6)
NetIC1_10: McuESP32 (IC1.10), LoraRFM (U2.15)
NetIC1_11: McuESP32 (IC1.11), LoraRFM (U2.16)
NetIC1_12: McuESP32 (IC1.12), LoraRFM (U2.14)
NetIC1_13: McuESP32 (IC1.13), LoraRFM (R18.1)
NetIC1_14: McuESP32 (IC1.14), LoraRFM (R17.1)
NetIC1_16: McuESP32 (IC1.16), LoraRFM (R16.1)
NetIC1_23: McuESP32 (IC1.23), LoraRFM (U2.5)
NetIC1_29: McuESP32 (IC1.29), SdCard (J14.2 R14.1)
NetIC1_30: McuESP32 (IC1.30), SdCard (J14.5)
NetIC1_31: McuESP32 (IC1.31), SdCard (J14.7 R13.1)
NetIC1_36: McuESP32 (IC1.36), MaxModule (U3.6 U3.7)
NetIC1_37: McuESP32 (IC1.37), SdCard (J14.3 R15.1)
NetJ1_1: MainBlockConnection (J1.1), MaxModule (U3.5)
NetJ2_2: MainBlockConnection (J2.2), MaxModule (U3.8)